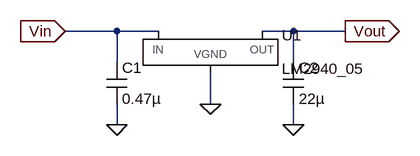
[diagram p0: schematic LDO_Schematic.asc]
LDO_Schematic.asc, the LTspice schematic file:
Version 4.1
SHEET 1 880 680
WIRE 32 144 -48 144
WIRE 96 144 32 144
WIRE 304 144 256 144
WIRE 384 144 304 144
WIRE 32 192 32 144
WIRE 304 192 304 144
WIRE 176 256 176 208
WIRE 32 288 32 256
WIRE 304 288 304 256
FLAG 176 256 0
FLAG 32 288 0
FLAG 304 288 0
FLAG -48 144 Vin
IOPIN -48 144 In
FLAG 384 144 Vout
IOPIN 384 144 Out
SYMBOL ZZZ\\VolReg\\LM2940 176 160 R0
SYMATTR InstName U1
SYMBOL cap 16 192 R0
SYMATTR InstName C1
SYMATTR Value 0.47µ
SYMBOL cap 288 192 R0
WINDOW 3 24 56 Left 2
SYMATTR InstName C2
SYMATTR Value 22µ
SYMATTR Description Capacitor
SYMATTR Type cap
SYMATTR SpiceLine V=16 Irms=0 Rser=11 Lser=0 mfg="AVX" pn="TAJA105K016" type="Tantalum"

The netlist it stands for:
* LDO_Schematic.asc
X§U1 Vin Vout 0 LM2940_05  ; pins IN OUT VGND
C1 Vin 0 0.47µ
C2 Vout 0 22µ V=16 Irms=0 Rser=11 Lser=0 mfg="AVX" pn="TAJA105K016" type="Tantalum"
.backanno
.end